# Altium schematic sheet BlockDiagram.SchDoc
size Letter; DrawnBy: Adrianna Ascalon; Organization: UW Robotics; Address1: 200 University Avenue; Address2: Waterloo; Address3: Ontario; Address4: Canada N2L 3G6
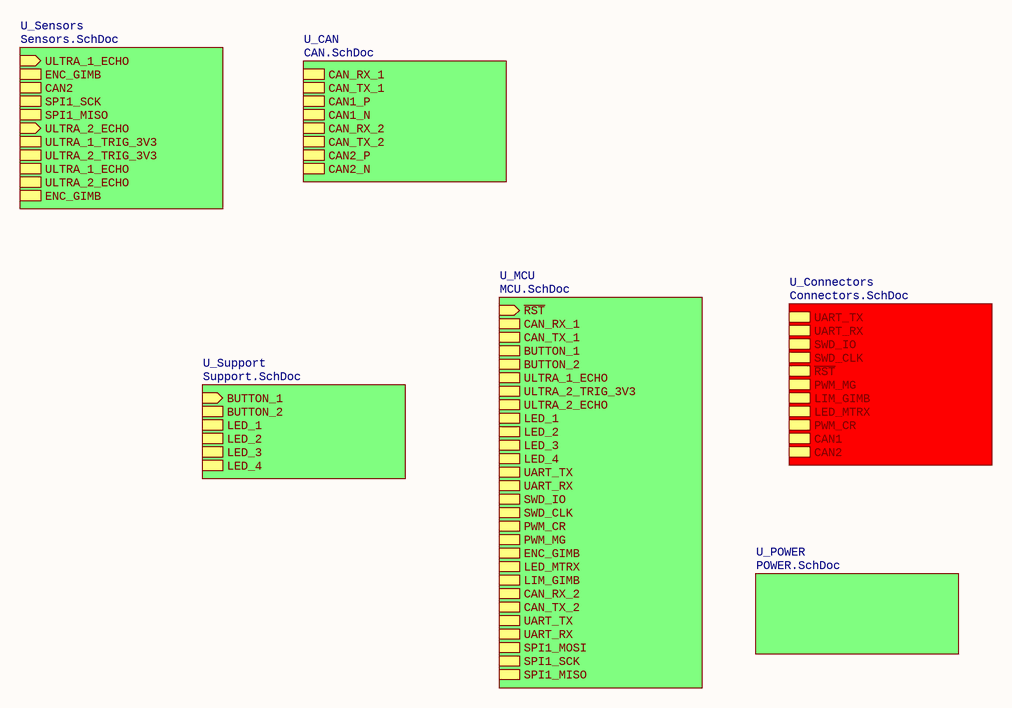
[diagram p0: BlockDiagram.SchDoc]

## Sub-sheets
U_CAN = CAN.SchDoc: CAN_RX_1, CAN_TX_1, CAN1_P, CAN1_N, CAN_RX_2, CAN_TX_2, CAN2_P, CAN2_N
U_Connectors = Connectors.SchDoc: UART_TX, UART_RX, SWD_IO, SWD_CLK, ~{RST}, PWM_MG, LIM_GIMB, LED_MTRX, PWM_CR, CAN1 (harness CAN1), CAN2 (harness CAN1)
U_MCU = MCU.SchDoc: ~{RST} (in), CAN_RX_1, CAN_TX_1, BUTTON_1, BUTTON_2, ULTRA_1_ECHO, ULTRA_2_TRIG_3V3, ULTRA_2_ECHO, LED_1, LED_2, LED_3, LED_4, UART_TX, UART_RX, SWD_IO, SWD_CLK, PWM_CR, PWM_MG, ENC_GIMB, LED_MTRX, LIM_GIMB, CAN_RX_2, CAN_TX_2, UART_TX, UART_RX, SPI1_MOSI, SPI1_SCK, SPI1_MISO
U_POWER = POWER.SchDoc: no entries
U_Sensors = Sensors.SchDoc: ULTRA_1_ECHO (in), ENC_GIMB, CAN2, SPI1_SCK, SPI1_MISO, ULTRA_2_ECHO (in), ULTRA_1_TRIG_3V3, ULTRA_2_TRIG_3V3, ULTRA_1_ECHO, ULTRA_2_ECHO, ENC_GIMB
U_Support = Support.SchDoc: BUTTON_1 (in), BUTTON_2, LED_1, LED_2, LED_3, LED_4

## Notes on the sheet
- Title
- Size:
- Date:
- Letter
- Drawn By:
- Sheet
- of
- File: